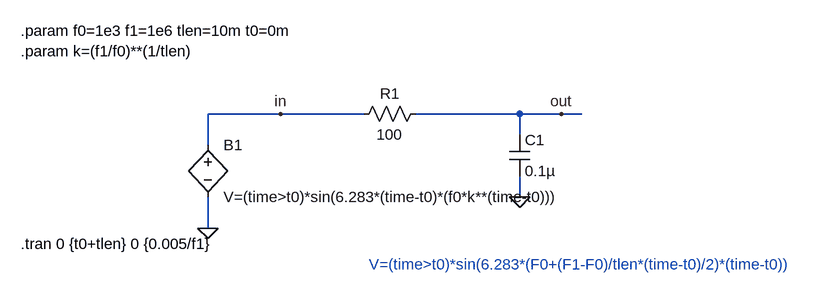
[diagram p0: schematic Stability.asc]
Stability.asc, the LTspice schematic file:
Version 4
SHEET 1 1156 680
WIRE 240 80 128 80
WIRE 368 80 240 80
WIRE 608 80 448 80
WIRE 672 80 608 80
WIRE 704 80 672 80
WIRE 608 112 608 80
WIRE 128 128 128 80
WIRE 608 208 608 176
WIRE 128 256 128 208
FLAG 128 256 0
FLAG 608 208 0
FLAG 240 80 in
FLAG 672 80 out
SYMBOL bv 128 112 R0
SYMATTR InstName B1
SYMATTR Value V=(time>t0)*sin(6.283*(time-t0)*(f0*k**(time-t0)))
SYMBOL res 464 64 R90
WINDOW 0 0 56 VBottom 2
WINDOW 3 32 56 VTop 2
SYMATTR InstName R1
SYMATTR Value 100
SYMBOL cap 592 112 R0
SYMATTR InstName C1
SYMATTR Value 0.1µ
TEXT -160 -48 Left 2 !.param f0=1e3 f1=1e6 tlen=10m t0=0m\n.param k=(f1/f0)**(1/tlen)
TEXT -160 280 Left 2 !.tran 0 {t0+tlen} 0 {0.005/f1}
TEXT 376 312 Left 2 ;V=(time>t0)*sin(6.283*(F0+(F1-F0)/tlen*(time-t0)/2)*(time-t0))

The netlist it stands for:
* Stability.asc
B1 in 0 V=(time>t0)*sin(6.283*(time-t0)*(f0*k**(time-t0)))
R1 out in 100
C1 out 0 0.1µ
.param f0=1e3 f1=1e6 tlen=10m t0=0m
.param k=(f1/f0)**(1/tlen)
.tran 0 {t0+tlen} 0 {0.005/f1}
* V=(time>t0)*sin(6.283*(F0+(F1-F0)/tlen*(time-t0)/2)*(time-t0))
.backanno
.end